# Altium schematic sheet Clock.SchDoc: Clock
size 431 x 279 mm; Date: Not shown in title block; ApprovedBy: Not shown in title block; CheckedBy: Not shown in title block; Author: Not shown in title block; CompanyName: Not shown in title block; Engineer: Not shown in title block; Revision: 0.1; PageSetup: Record=PageOptions|CenterHorizontal=True|CenterVertical=True|PrintScale=1.00|XCorrection=1.00|YCorrection=1.00|PrintKind=0|BorderSize=5000000|LeftOffset=0|BottomOffset=0|Orientation=2|PaperLength=1000|PaperWidth=1000|Scale=100|PaperSource=15|PrintQuality=600|MediaType=1|DitherType=10|PaperKind=Letter|PrintScaleMode=1; DocumentNumber: 1; SheetNumber: 1; SheetTotal: 1; CurrentTime: Not shown in title block; CurrentDate: Not shown in title block; Time: Not shown in title block; DocumentFullPathAndName: Not shown in title block; DocumentName: Not shown in title block; ModifiedDate: Not shown in title block; ImagePath: Not shown in title block
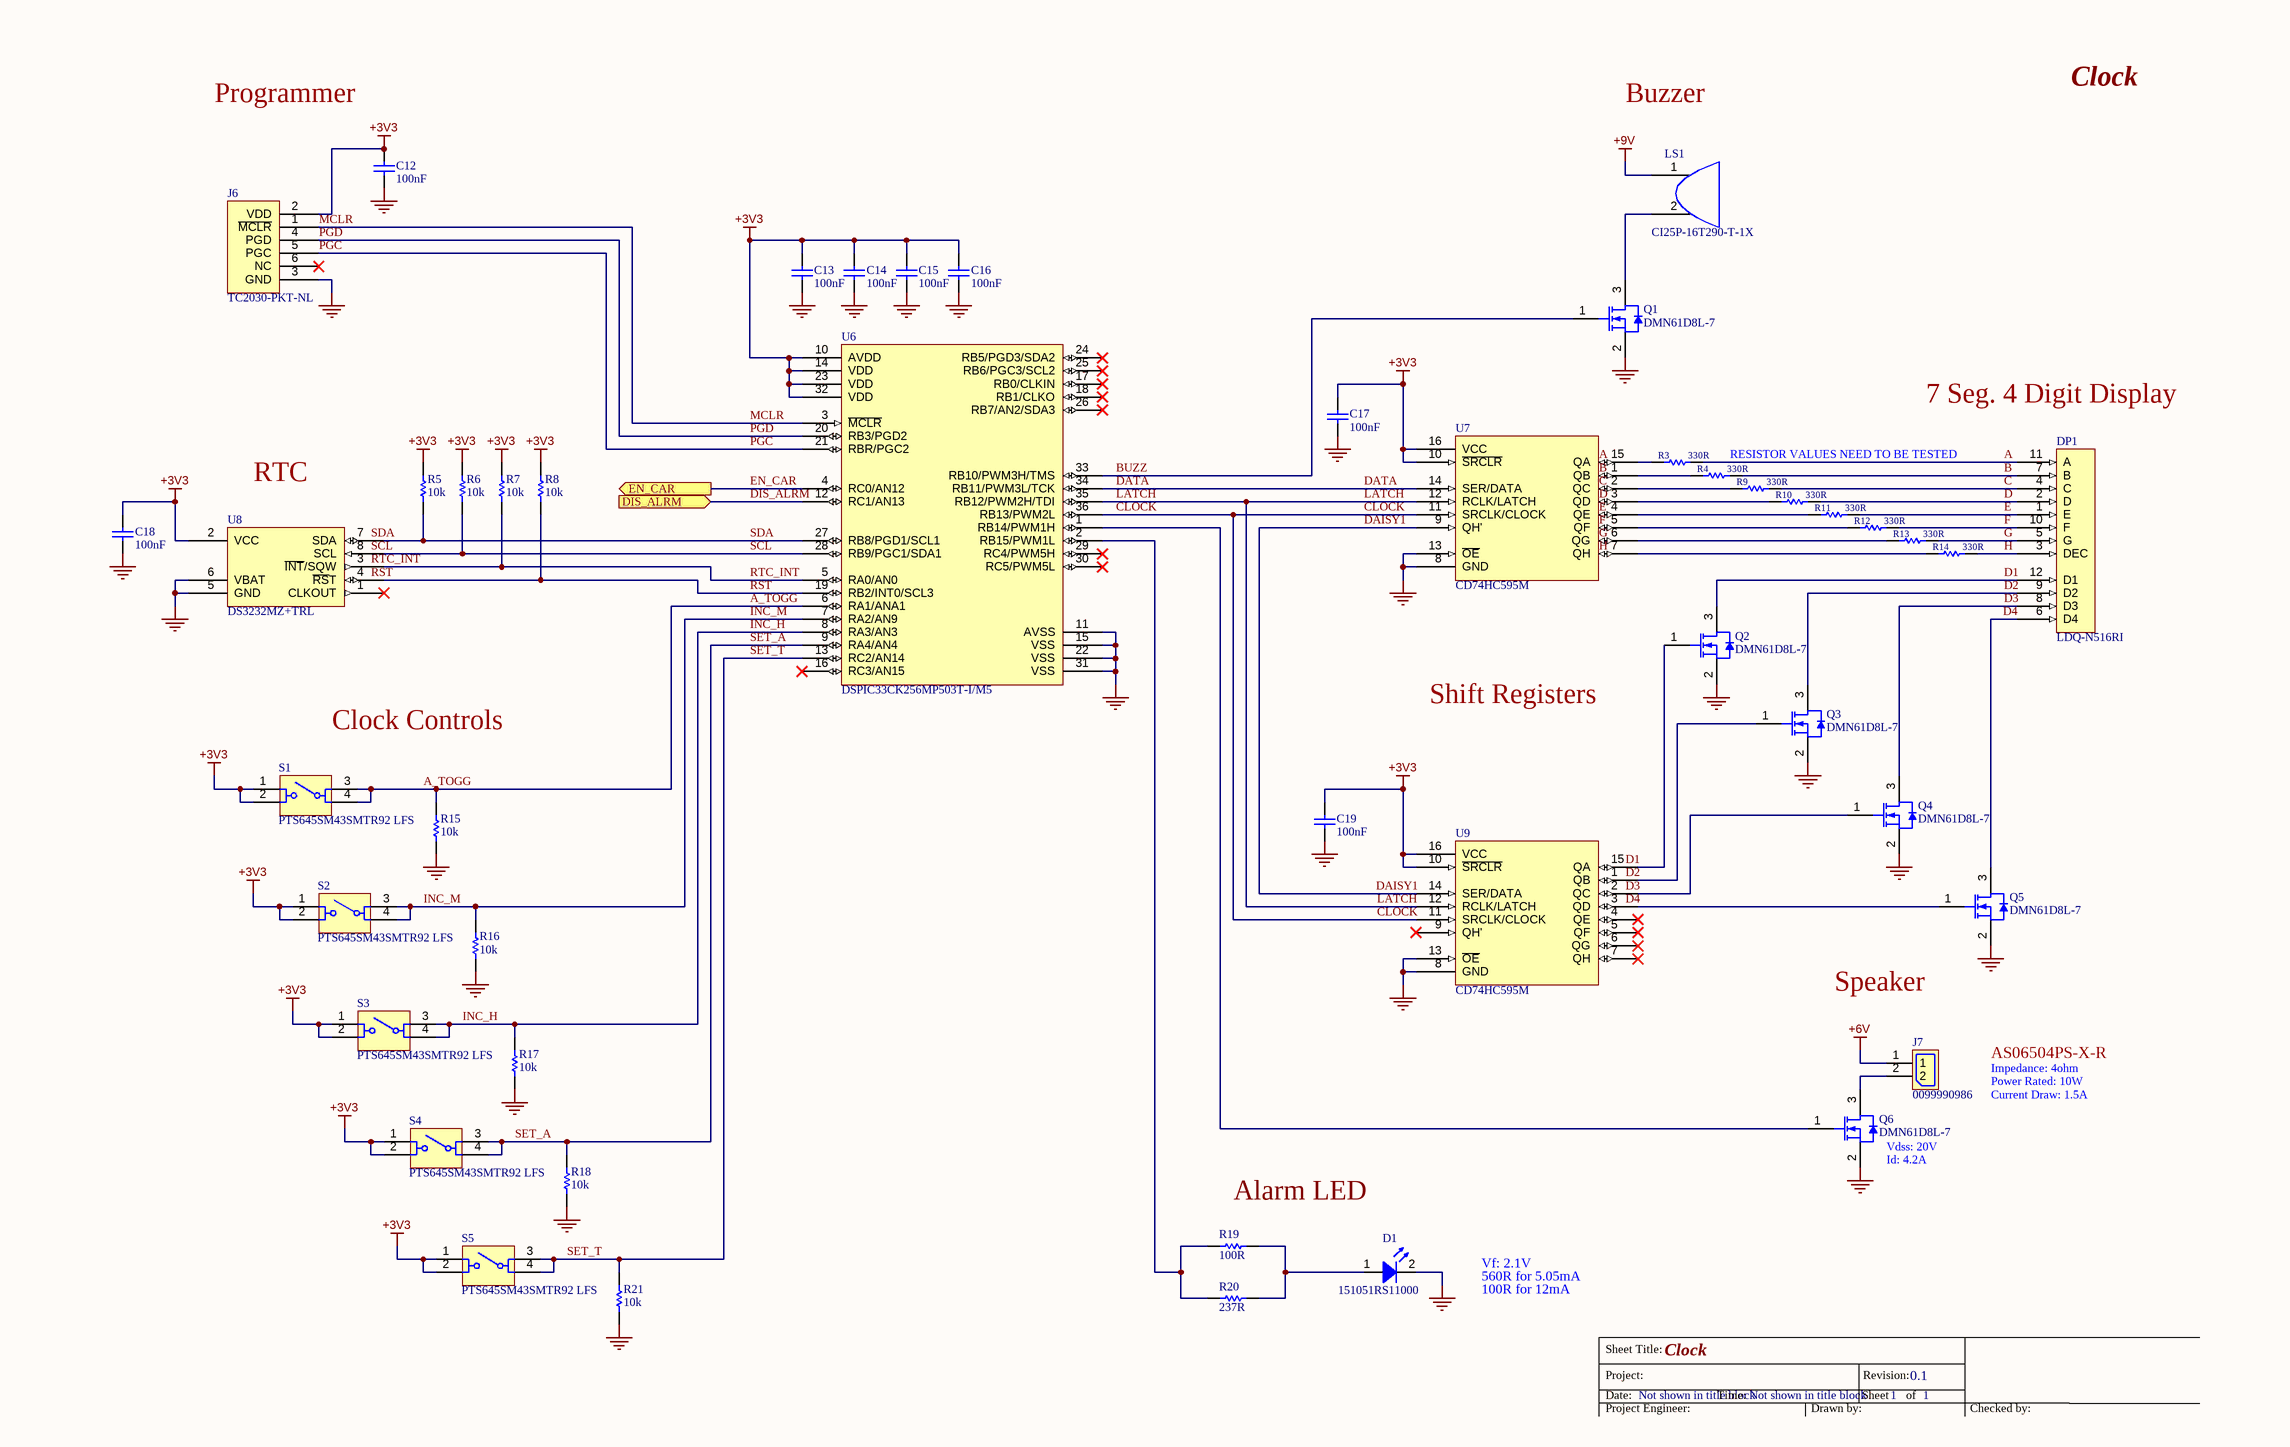
[diagram p0: Clock.SchDoc]

## Parts
C12  100nF  [C0402]
C13  100nF  [C0402]
C14  100nF  [C0402]
C15  100nF  [C0402]
C16  100nF  [C0402]
C17  100nF  [C0402]
C18  100nF  [C0402]
C19  100nF  [C0402]
D1  151051RS11000  [151051RS11000]
DP1  LDQ-N516RI  [LDQ-N516RI]
J6  TC2030-PKT-NL  [TC2030-PKT-NL]
J7  0099990986  [0099990986]
LS1  CI25P-16T290-T-1X  [CI25P-16T290-T-1X]
Q1  DMN61D8L-7  [SOT90P240X102-3N]
Q2  DMN61D8L-7  [SOT90P240X102-3N]
Q3  DMN61D8L-7  [SOT90P240X102-3N]
Q4  DMN61D8L-7  [SOT90P240X102-3N]
Q5  DMN61D8L-7  [SOT90P240X102-3N]
Q6  DMN61D8L-7  [SOT90P240X102-3N]
R3  330R  [RESC1005X04N]
R4  330R  [RESC1005X04N]
R5  10k  [RESC1005X04N]
R6  10k  [RESC1005X04N]
R7  10k  [RESC1005X04N]
R8  10k  [RESC1005X04N]
R9  330R  [RESC1005X04N]
R10  330R  [RESC1005X04N]
R11  330R  [RESC1005X04N]
R12  330R  [RESC1005X04N]
R13  330R  [RESC1005X04N]
R14  330R  [RESC1005X04N]
R15  10k  [RESC1005X04N]
R16  10k  [RESC1005X04N]
R17  10k  [RESC1005X04N]
R18  10k  [RESC1005X04N]
R19  100R  [RESC1005X04N]
R20  237R  [RESC1005X04N]
R21  10k  [RESC1005X04N]
S1  PTS645SM43SMTR92 LFS  [PTS645SM43SMTR92 LFS]
S2  PTS645SM43SMTR92 LFS  [PTS645SM43SMTR92 LFS]
S3  PTS645SM43SMTR92 LFS  [PTS645SM43SMTR92 LFS]
S4  PTS645SM43SMTR92 LFS  [PTS645SM43SMTR92 LFS]
S5  PTS645SM43SMTR92 LFS  [PTS645SM43SMTR92 LFS]
U6  DSPIC33CK256MP503T-I/M5  [QFN40P500X500X60_HS-37N]
U7  CD74HC595M
U8  DS3232MZ+TRL
U9  CD74HC595M

## Ports
DIS_ALRM (in), EN_CAR (out)

## Nets
+3V3: C12.2 C13.2 C14.2 C15.2 C16.2 C17.2 C18.2 C19.2 J6.2(VDD) R5.2 R6.2 R7.2 R8.2 S1.1 S1.2 S2.1 S2.2 S3.1 S3.2 S4.1 S4.2 S5.1 S5.2 U6.10(AVDD) U6.14(VDD) U6.23(VDD) U6.32(VDD) U7.10(~{SRCLR}) U7.16(VCC) U8.2(VCC) U9.10(~{SRCLR}) U9.16(VCC)
+6V: J7.1
+9V: LS1.1(VCC)
GND: C12.1 C13.1 C14.1 C15.1 C16.1 C17.1 C18.1 C19.1 D1.2(K) J6.3(GND) Q1.2(S) Q2.2(S) Q3.2(S) Q4.2(S) Q5.2(S) Q6.2(S) R15.1 R16.1 R17.1 R18.1 R21.1 U6.11(AVSS) U6.15(VSS) U6.22(VSS) U6.31(VSS) U7.8(GND) U7.13(~{OE}) U8.5(GND) U8.6(VBAT) U9.8(GND) U9.13(~{OE})
A: DP1.11(A) R3.2
A_TOGG: R15.2 S1.3 S1.4 U6.6(RA1/ANA1)
B: DP1.7(B) R4.2
BUZZ: Q1.1(G) U6.33(RB10/PWM3H/TMS)
C: DP1.4(C) R9.2
CLOCK: U6.36(RB13/PWM2L) U7.11(SRCLK/CLOCK) U9.11(SRCLK/CLOCK)
D: DP1.2(D) R10.2
D1: DP1.12(D1) Q2.3(D)
D2: DP1.9(D2) Q3.3(D)
D3: DP1.8(D3) Q4.3(D)
D4: DP1.6(D4) Q5.3(D)
DAISY1: U7.9(QH') U9.14(SER/DATA)
DATA: U6.34(RB11/PWM3L/TCK) U7.14(SER/DATA)
DIS_ALRM: U6.12(RC1/AN13) ; port DIS_ALRM
E: DP1.1(E) R11.2
EN_CAR: U6.4(RC0/AN12) ; port EN_CAR
F: DP1.10(F) R12.2
G: DP1.5(G) R13.2
H: DP1.3(DEC) R14.2
INC_H: R17.2 S3.3 S3.4 U6.8(RA3/AN3)
INC_M: R16.2 S2.3 S2.4 U6.7(RA2/AN9)
LATCH: U6.35(RB12/PWM2H/TDI) U7.12(RCLK/LATCH) U9.12(RCLK/LATCH)
MCLR: J6.1(~{MCLR}) U6.3(~{MCLR})
PGC: J6.5(PGC) U6.21(RBR/PGC2)
PGD: J6.4(PGD) U6.20(RB3/PGD2)
RST: R8.1 U6.19(RB2/INT0/SCL3) U8.4(~{RS}T)
RTC_INT: R7.1 U6.5(RA0/AN0) U8.3(~{INT}/SQW)
SCL: R6.1 U6.28(RB9/PGC1/SDA1) U8.8(SCL)
SDA: R5.1 U6.27(RB8/PGD1/SCL1) U8.7(SDA)
SET_A: R18.2 S4.3 S4.4 U6.9(RA4/AN4)
SET_T: R21.2 S5.3 S5.4 U6.13(RC2/AN14)
NetD1_1: D1.1(A) R19.2 R20.2
NetJ7_2: J7.2 Q6.3(D)
NetLS1_2: LS1.2(GND) Q1.3(D)
NetQ2_1: Q2.1(G) U9.15(QA)
NetQ3_1: Q3.1(G) U9.1(QB)
NetQ4_1: Q4.1(G) U9.2(QC)
NetQ5_1: Q5.1(G) U9.3(QD)
NetQ6_1: Q6.1(G) U6.1(RB14/PWM1H)
NetR3_1: R3.1 U7.15(QA)
NetR4_1: R4.1 U7.1(QB)
NetR9_1: R9.1 U7.2(QC)
NetR10_1: R10.1 U7.3(QD)
NetR11_1: R11.1 U7.4(QE)
NetR12_1: R12.1 U7.5(QF)
NetR13_1: R13.1 U7.6(QG)
NetR14_1: R14.1 U7.7(QH)
NetR19_1: R19.1 R20.1 U6.2(RB15/PWM1L)

Not connected (* = marked no-connect by the designer): J6 6(NC)*; U6 16(RC3/AN15)* 17(RB0/CLKIN)* 18(RB1/CLKO)* 24(RB5/PGD3/SDA2)* 25(RB6/PGC3/SCL2)* 26(RB7/AN2/SDA3)* 29(RC4/PWM5H)* 30(RC5/PWM5L)*; U8 1(CLKOUT)*; U9 4(QE)* 5(QF)* 6(QG)* 7(QH)* 9(QH')*

## Notes on the sheet
- Programmer
- Buzzer
- 7 Seg. 4 Digit Display
- RTC
- (near R4) RESISTOR VALUES NEED TO BE TESTED
- Clock Controls
- Shift Registers
- Speaker
- Impedance: 4ohm
- AS06504PS-X-R
- Power Rated: 10W
- Current Draw: 1.5A
- (near Q6) Vdss: 20V
- (near Q6) Id: 4.2A
- Vf: 2.1V
- 560R for 5.05mA
- 100R for 12mA
- Labels drawn without touching a wire or pin: A, Alarm LED, B, C, D, D1, D2, D3, D4, E, F, G, H, RST, RTC_INT, SCL, SDA
- Sheet Title:
- Date:
- Project:
- Time:
- Sheet
- Revision:
- of
- Project Engineer:
- Drawn by:
- Checked by:

## Library data of the parts
C12-C19 = CL05A104KA5NNNC: Ceramic Capacitor, Multilayer, Ceramic, 25V, 10% +Tol, 10% -Tol, X5R, 15% TC, 0.1uF, Surface Mount, 0402; Manufacturer: Samsung; Part Number: CL05A104KA5NNNC; Supplier 1: Digi-Key; Supplier Part Number 1: 1276-1043-1-ND; Manufacturer Part Number: CL05A104KA5NNNC; Capacitance: 100nF
D1 = 151051RS11000: Manufacturer: Wurth Electronics; Part Number: 151051RS11000; Manufacturer Part Number: 151051RS11000; Supplier 1: Digi-Key; Supplier Part Number 1: 732-5016-ND
DP1 = LDQ-N516RI: DISP 7SEG 0.56" QUAD RED 12DIP; Manufacturer: Lumex; Part Number: LDQ-N516RI; Supplier 1: Digi-Key; Supplier Part Number 1: 67-1450-ND; Manufacturer Part Number: LDQ-N516RI
J6 = TC2030-PKT-NL: Pogo pin cable for PicKit 3; Part Number: TC2030-PKT-NL
J7 = 0099990986: Board Connector, 2 Contact(s), 1 Row(s), Male, Straight, 0.098 inch Pitch, Solder Terminal, Locking, Receptacle; Manufacturer: Molex; Insulation Resistance: 1GR; Number of Contacts: 2; Contact Resistance: 20mR; Part Number: 0099990986; Supplier 1: Digi-Key; Supplier Part Number 1: WM4271-ND; Manufacturer Part Number: 99-99-0986; Min Operating Temperature: -40°C; Max Operating Temperature: 105°C; Termination: Solder; Flammability Rating: UL94 V-0; ComponentLink1URL: https://datasheet.ciiva.com:443/pdfs/VipMasterIC/IC/MOLE/MOLES56051/MOLES56051-1.pdf?src-supplier=IHS+Markit; ComponentLink1Description: https://datasheet.ciiva.com:443/pdfs/VipMasterIC/IC/MOLE/MOLES56051/MOLES56051-1.pdf?src-supplier=IHS+Markit; Mount: Board; REACH SVHC: Yes; ComponentLink2URL: https://datasheet.ciiva.com/738/099990989-sd-738043.pdf?src-supplier=Digi-Key; ComponentLink2Description: https://datasheet.ciiva.com/738/099990989-sd-738043.pdf?src-supplier=Digi-Key; ComponentLink3URL: https://datasheet.ciiva.com/11747/0900766b80dc7cb9-11747620.pdf?src-supplier=RSComponents; ComponentLink3Description: https://datasheet.ciiva.com/11747/0900766b80dc7cb9-11747620.pdf?src-supplier=RSComponents; Connector Type: BOARD CONNECTOR
LS1 = CI25P-16T290-T-1X: Buzzer Piezo 12V 25.4MM Th; Manufacturer: Challenge Electronics; Part Number: CI25P-16T290-T-1X; Supplier 1: DigiKey; Supplier Part Number 1: 2603-CI25P-16T290-T-1X-ND; Manufacturer Part Number: CI25P-16T290-T-1X; Pricing 1: 1=5.97000, 10=4.92500, 25=4.54040, 50=4.26140, 100=3.99320, 500=3.61760 (USD); Stock 1: 484
Q1-Q6 = DMN61D8L-7: MOSFET N-CH 60V 470MA SOT23; Manufacturer: Diodes; Rise Time: 1.8ns; Drain to Source Voltage (Vdss): 50V; Continuous Drain Current (ID): 200mA; Rds On Max: 3.5R; Input Capacitance: 50pF; Max Power Dissipation: 350mW; Turn-On Delay Time: 2.2ns; Turn-Off Delay Time: 5.3ns; Fall Time: 5.1ns; Threshold Voltage: 1.25V; Gate to Source Voltage (Vgs): 20V; Element Configuration: Single; Number of Channels: 1; Part Number: DMN61D8L-7; Supplier 1: Digi-Key; Supplier Part Number 1: DMN61D8L-7DICT-ND; Manufacturer Part Number: DMN61D8L-7; Mount: Surface Mount; Case/Package: SOT-23; Number of Pins: 3; Weight: 0.03g; Min Operating Temperature: -55°C; Max Operating Temperature: 150°C; Packaging: Tape and Reel; Drain to Source Breakdown Voltage: 50V; Drain to Source Resistance: 3.5R; Package Quantity: 3000; REACH SVHC: No SVHC; Stock: 8238; Pricing: 1=0.56000, 10=0.48300, 25=0.45040, 100=0.33460, 500=0.26126, 1000=0.21236 (USD)
R3 R4 R9-R14 = RC0402FR-07330RL: Res Thick Film 0402 330 Ohm 1% 0.063W(1/16W) ±100ppm/C Pad SMD T/R; Manufacturer: Yageo; Part Number: RC0402FR-07330RL; Supplier 1: Digi-Key; Supplier Part Number 1: 311-330LRCT-ND; Manufacturer Part Number: RC0402FR-07330RL; Stock 1: 524859; Pricing 1: 1=0.10000, 10=0.01600, 100=0.00660, 1000=0.00299, 2500=0.00259, 5000=0.00214 (USD); Case/Package: 0402; Case Code (Metric): 1005; Case Code (Imperial): 0402; Resistance: 330R; RoHS: Yes; Category: Chip SMD Resistors
R5-R8 R15-R18 R21 = RC0402FR-0710KL: RES SMD 10K OHM 1% 1/16W 0402; Manufacturer: Yageo; Power Rating: 62.5mW; Voltage Rating: 50V; Temperature Coefficient: 100ppm/°C; Part Number: RC0402FR-0710KL; Value: 10k; Supplier 1: Digi-Key; Supplier Part Number 1: 311-10.0KLRCT-ND; Manufacturer Part Number: RC0402FR-0710KL; Stock 1: 14034353; Pricing 1: 1=0.1, 10=0.014, 100=0.0056, 1000=0.0025, 2500=0.0022, 5000=0.0018 (USD); Case/Package: 0402; Case Code (Metric): 1005; Case Code (Imperial): 0402; Min Operating Temperature: -55°C; Max Operating Temperature: 155°C; Packaging: Tape and Reel; Tolerance: 1%; Composition: Thick Film; Resistance: 10k; Military Standard: Not; Length: 1mm; Height: 0.32mm; Width: 0.5mm; Depth: 0.5mm; Lead Pitch: 0.2mm; REACH SVHC: No SVHC; Lead Free: Lead Free
  R5-R8: ComponentLink1URL: https://datasheet.ciiva.com/7660/38568-7660787.pdf; ComponentLink1Description: https://datasheet.ciiva.com/7660/38568-7660787.pdf; ComponentLink2URL: https://datasheet.ciiva.com/7849/1784430-7849813.pdf; ComponentLink2Description: https://datasheet.ciiva.com/7849/1784430-7849813.pdf; ComponentLink3URL: https://datasheet.ciiva.com/11808/0900766b80c66297-11808309.pdf; ComponentLink3Description: https://datasheet.ciiva.com/11808/0900766b80c66297-11808309.pdf; ComponentLink4URL: https://datasheet.ciiva.com/16744/pyu-rc0402-51-rohs-l-6-r-16744005.pdf; ComponentLink4Description: https://datasheet.ciiva.com/16744/pyu-rc0402-51-rohs-l-6-r-16744005.pdf; ComponentLink5URL: https://datasheet.ciiva.com/7849/1686128-7849814.pdf; ComponentLink5Description: https://datasheet.ciiva.com/7849/1686128-7849814.pdf; ComponentLink6URL: https://datasheet.ciiva.com/7849/1784430-7849815.pdf; ComponentLink6Description: https://datasheet.ciiva.com/7849/1784430-7849815.pdf; ComponentLink7URL: https://datasheet.ciiva.com/22747/1018594-22747512.pdf; ComponentLink7Description: https://datasheet.ciiva.com/22747/1018594-22747512.pdf; ComponentLink8URL: https://datasheet.ciiva.com/12667/pyu-rc0402-51-rohs-l-6-r-12667067.pdf; ComponentLink8Description: https://datasheet.ciiva.com/12667/pyu-rc0402-51-rohs-l-6-r-12667067.pdf; ComponentLink9URL: https://datasheet.ciiva.com/7983/1018594-7983486.pdf; ComponentLink9Description: https://datasheet.ciiva.com/7983/1018594-7983486.pdf
R19 = RC0402FR-07100RL: Fixed Resistor, Metal Glaze/thick Film, 0.0625W, 100ohm, 50V, 1% +/-Tol, 100ppm/Cel, Surface Mount, 0402; Manufacturer: Yageo; Power Rating: 62.5mW; Part Number: RC0402FR-07100RL; Supplier 1: Digi-Key; Supplier Part Number 1: 311-100LRCT-ND; Manufacturer Part Number: RC0402FR-07100RL; Case/Package: 0402; Case Code (Metric): 1005; Case Code (Imperial): 0402; Min Operating Temperature: -55°C; Max Operating Temperature: 155°C; Packaging: Tape and Reel; Tolerance: 1%; Resistance: 100R; Voltage Rating: 50V
R20 = RC0402FR-07237RL: Thick Film Resistors - SMD 237 OHM 1%; Manufacturer: Yageo; Power Rating: 62.5mW; Voltage Rating: 50V; Temperature Coefficient: 100ppm/°C; Part Number: RC0402FR-07237RL; Supplier 1: Digi-Key; Supplier Part Number 1: YAG3065DKR-ND; Manufacturer Part Number: RC0402FR-07237RL; Stock 1: 63050; Pricing 1: 1=0.1, 10=0.013, 100=0.0054, 1000=0.00244, 2500=0.00212, 5000=0.00175 (USD); Case/Package: 0402; Case Code (Metric): 1005; Case Code (Imperial): 0402; Min Operating Temperature: -55°C; Max Operating Temperature: 155°C; Packaging: Tape and Reel; Tolerance: 1%; Composition: Thick Film; Resistance: 237R; Military Standard: Not; Length: 1mm; Height: 0.016inch; Width: 0.5mm; Depth: 0.5mm; REACH SVHC: Unknown; Lead Free: Lead Free
S1 = PTS645SK50SMTR92LFS: RED TACTILE SWTICH - SMD; Manufacturer: ITT C&K; Current Rating: 50mA; Mechanical Life: 100000Cycles; Actuator Material: Nylon,Polyamide,PA66; Max Voltage Rating (DC): 12V; Throw Configuration: SPST; Operating Force: 260gf; Contact Resistance: 100mR; Illumination Type: Non-Illuminated,Illuminated; Actuator Length: 1.55mm; Switch Function: Off-Mom; Actuator Type: Standard; Part Number: PTS645SK50SMTR92LFS; ComponentLink1Description: https://datasheet.ciiva.com/29903/getdatasheetpartid-741134-29903854.pdf?src-supplier=Verical; ComponentLink1URL: https://datasheet.ciiva.com/29903/getdatasheetpartid-741134-29903854.pdf?src-supplier=Verical; ComponentLink2Description: https://datasheet.ciiva.com/14920/pts645-14920581.pdf?src-supplier=Digi-Key; ComponentLink2URL: https://datasheet.ciiva.com/14920/pts645-14920581.pdf?src-supplier=Digi-Key; Supplier 1: Digi-Key; Supplier Part Number 1: CKN9087CT-ND; Manufacturer Part Number: PTS645SK50SMTR92LFS; Stock 1: 336570; Pricing 1: 1=0.25000, 10=0.24200, 25=0.22960, 100=0.20780, 250=0.18944, 500=0.17610 (USD); Case/Package: SMD/SMT; Min Operating Temperature: -20°C; Max Operating Temperature: 60°C; Packaging: Tape and Reel; Package Quantity: 1; Termination: Gull Wing; Length: 6mm; Depth: 9mm; REACH SVHC: No SVHC; Lead Free: Lead Free; ComponentLink3URL: https://datasheet.ciiva.com/22637/1707731-22637358.pdf?src-supplier=Element14; ComponentLink3Description: https://datasheet.ciiva.com/22637/1707731-22637358.pdf?src-supplier=Element14; Mount: Surface Mount; Contact Plating: Silver; Contact Material: Bronze; Colour: Black; Max Current Rating: 50mA; Voltage Rating (DC): 12V; Orientation: Straight; RoHS: Yes; Category: Tactile Switches; Color: Red; Series: PTS645; RoHS Compliant: Yes
S2-S5 = PTS645SL50SMTR92LFS: BLACK TACTILE SWTICH - SMD; Manufacturer: ITT C&K; Current Rating: 50mA; Mechanical Life: 100000Cycles; Actuator Material: Nylon,Polyamide,PA66; Max Voltage Rating (DC): 12V; Throw Configuration: SPST; Operating Force: 130gf; Illumination Type: Non-Illuminated; Switch Function: Off-Mom; Actuator Type: Standard; Part Number: PTS645SL50SMTR92LFS; ComponentLink1Description: https://datasheet.ciiva.com/26927/getdatasheetpartid-760859-26927133.pdf?src-supplier=Verical; ComponentLink1URL: https://datasheet.ciiva.com/26927/getdatasheetpartid-760859-26927133.pdf?src-supplier=Verical; ComponentLink2Description: https://datasheet.ciiva.com/14920/pts645-14920742.pdf?src-supplier=Digi-Key; ComponentLink2URL: https://datasheet.ciiva.com/14920/pts645-14920742.pdf?src-supplier=Digi-Key; Supplier 1: Digi-Key; Supplier Part Number 1: CKN9088CT-ND; Manufacturer Part Number: PTS645SL50SMTR92LFS; Stock 1: 183131; Pricing 1: 1=0.25000, 10=0.24200, 25=0.22960, 100=0.20780, 250=0.18944, 500=0.17610 (USD); Min Operating Temperature: -20°C; Max Operating Temperature: 60°C; Packaging: Tape and Reel; Package Quantity: 1; Termination: Gull Wing; Length: 6mm; Depth: 9mm; REACH SVHC: No SVHC; Lead Free: Lead Free; ComponentLink3URL: https://datasheet.ciiva.com/14920/pts645-14920743.pdf?src-supplier=Digi-Key; ComponentLink3Description: https://datasheet.ciiva.com/14920/pts645-14920743.pdf?src-supplier=Digi-Key; Mount: Surface Mount; Contact Plating: Silver; Contact Material: Bronze; Colour: Black; Max Current Rating: 50mA; Voltage Rating (DC): 12V; Orientation: Straight; ComponentLink4URL: https://datasheet.ciiva.com/14920/pts645-14920744.pdf?src-supplier=Digi-Key; ComponentLink4Description: https://datasheet.ciiva.com/14920/pts645-14920744.pdf?src-supplier=Digi-Key; ComponentLink5URL: https://datasheet.ciiva.com/46429/1839862-46429337.pdf?src-supplier=Element14; ComponentLink5Description: https://datasheet.ciiva.com/46429/1839862-46429337.pdf?src-supplier=Element14; ComponentLink6URL: https://datasheet.ciiva.com/46429/1839862-46429338.pdf?src-supplier=Element14; ComponentLink6Description: https://datasheet.ciiva.com/46429/1839862-46429338.pdf?src-supplier=Element14; RoHS: Yes; Category: Tactile Switches; Color: Black; Series: PTS645; RoHS Compliant: Yes
U6 = DSPIC33CK256MP503T-I/M5: MCU 16-Bit dsPIC DSC Modified Harvard Architecture 256KB Flash 3V to 3.6V 36-Pin UQFN T/R; Manufacturer: Microchip; Part Number: DSPIC33CK256MP503T-I/M5; Supplier 1: Digi-Key; Supplier Part Number 1: DSPIC33CK256MP503T-I/M5CT-ND; Manufacturer Part Number: DSPIC33CK256MP503T-I/M5; RoHS: No; Stock 1: 2650; Pricing 1: 1=4.40000, 25=4.03720, 100=3.82500 (USD); Category: Microcontrollers; ComponentLink1URL: http://www.microchip.com/mymicrochip/filehandler.aspx?ddocname=en606233&src-supplier=Digi-Key; ComponentLink1Description: http://www.microchip.com/mymicrochip/filehandler.aspx?ddocname=en606233&src-supplier=Digi-Key
U7 U9 = CD74HC595M: Shift Shift Register 1 Element 8 Bit 16-SOIC
U8 = DS3232MZ+TRL: IC RTC CLK/CALENDAR I2C 8-SOIC